# EAGLE design Adafruit I2C QT Rotary Encoder (EAGLE 9.6.2)
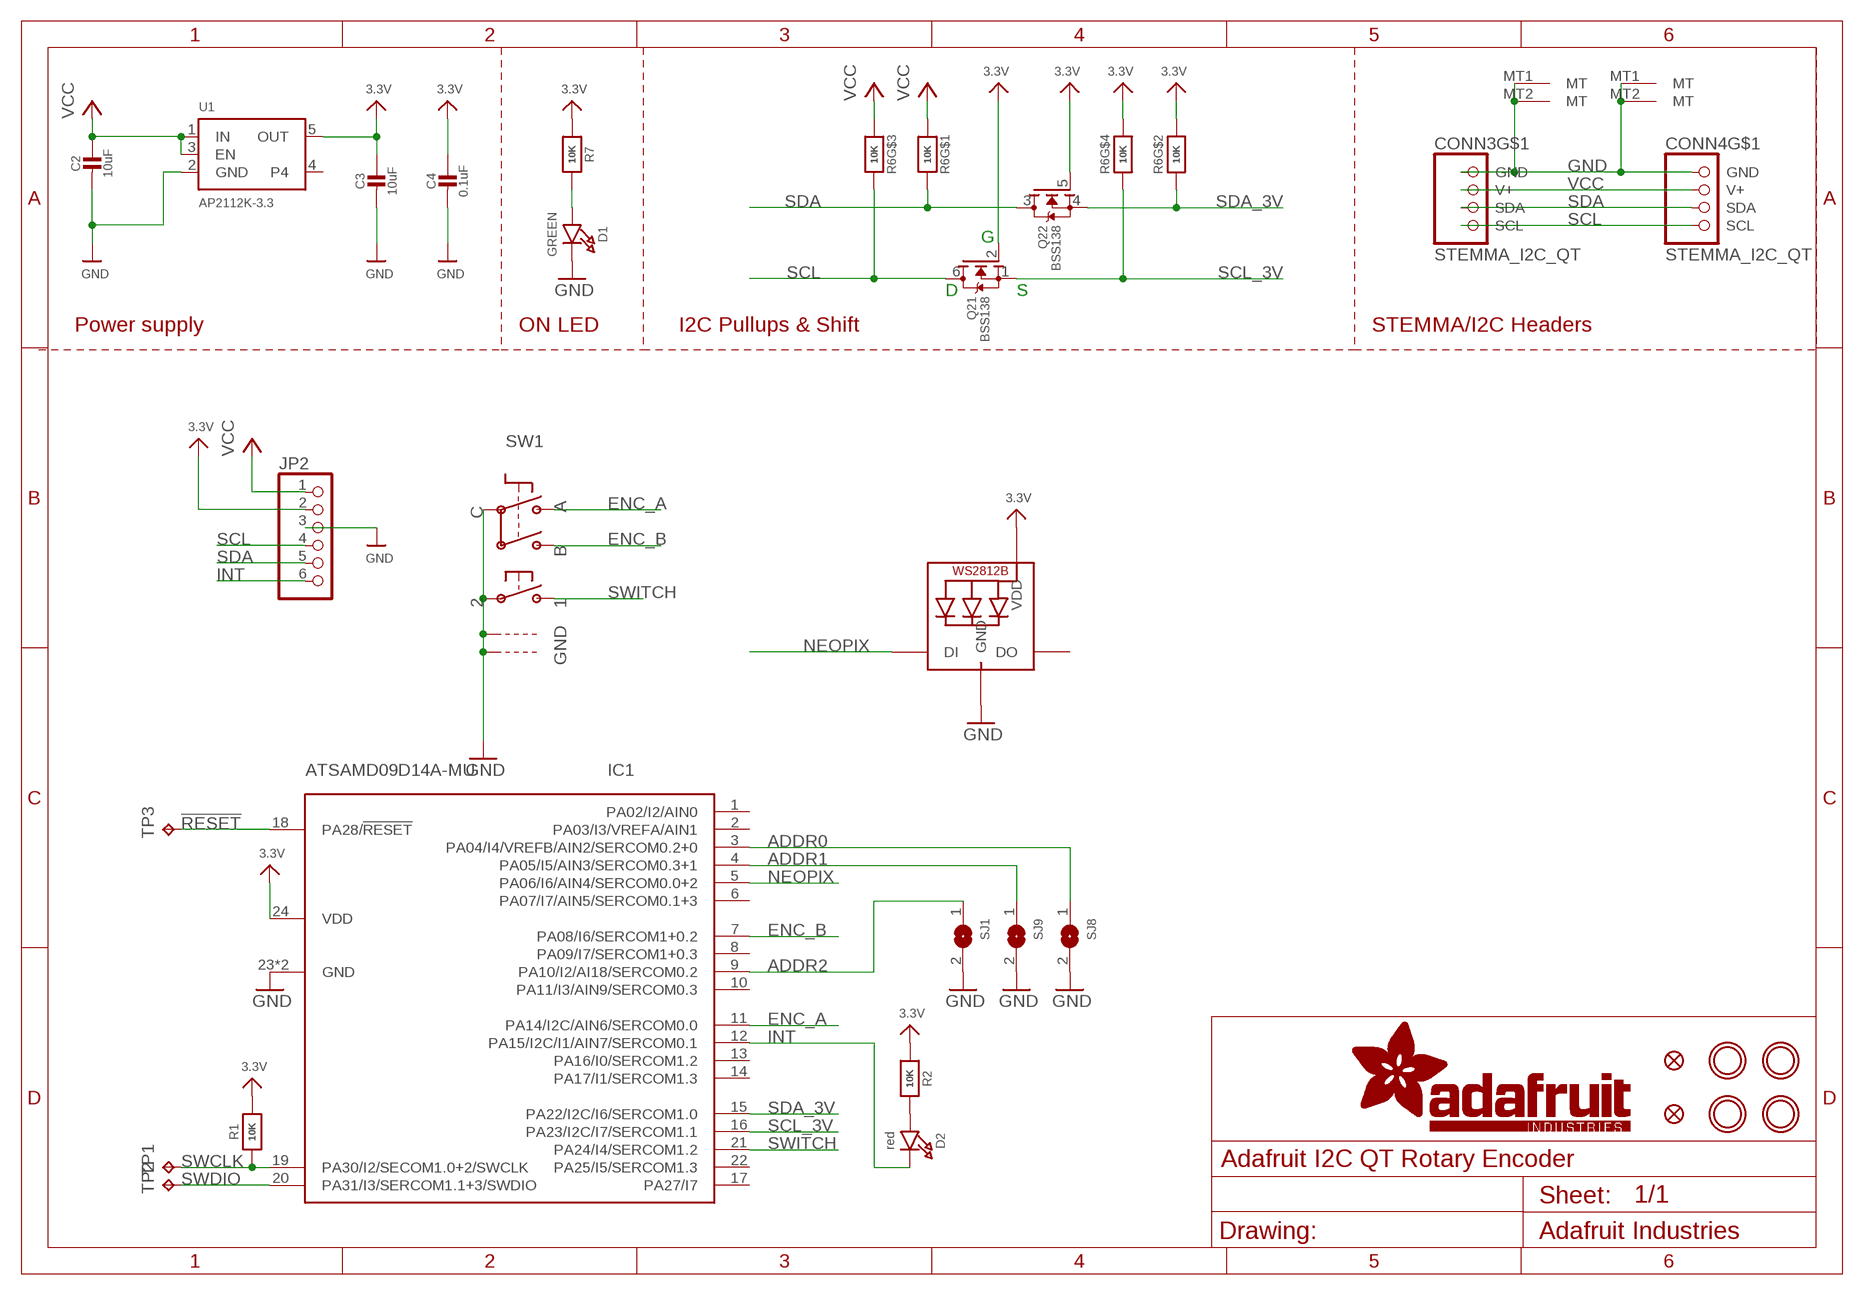
[diagram p0: schematic, sheet 1]

## Parts
C2  10uF  CAP_CERAMIC0805-NOOUTLINE  [0805-NO]
C3  10uF  CAP_CERAMIC0805-NOOUTLINE  [0805-NO]
C4  0.1uF  CAP_CERAMIC0603_NO  [0603-NO]
CONN3  STEMMA_I2C_QT  [JST_SH4]
CONN4  STEMMA_I2C_QT  [JST_SH4]
D1  GREEN  LED0603_NOOUTLINE  [CHIPLED_0603_NOOUTLINE]
D2  red  LED0603_NOOUTLINE  [CHIPLED_0603_NOOUTLINE]
FID3  FIDUCIAL_1MM  [FIDUCIAL_1MM]
FID4  FIDUCIAL_1MM  [FIDUCIAL_1MM]
IC1  ATSAMD09D14A-MU  [QFN24_4MM]
JP2  HEADER-1X670MIL  [1X06_ROUND_70]
LED1  WS2812B_SK6812E  [NEO3535_REVERSE]
Q2  BSS138  MOSFET-N_DUAL  [SOT363]
R1  10K  RESISTOR_0603_NOOUT  [0603-NO]
R2  10K  RESISTOR_0603_NOOUT  [0603-NO]
R6  10K  RESISTOR_4PACK  [RESPACK_4X0603]
R7  10K  RESISTOR_0603_NOOUT  [0603-NO]
SJ1  SOLDERJUMPER  [SOLDERJUMPER_ARROW_NOPASTE]
SJ8  SOLDERJUMPER  [SOLDERJUMPER_ARROW_NOPASTE]
SJ9  SOLDERJUMPER  [SOLDERJUMPER_ARROW_NOPASTE]
SW1  ENCODER_PLUS_SWITCH_BOURNS_PEC11  [PEC11+SWITCH]
TP1  TPTP15R  [TP15R]
TP2  TPTP15R  [TP15R]
TP3  TPTP15R  [TP15R]
U1  AP2112K-3.3  VREG_SOT23-5  [SOT23-5]
U$25  MOUNTINGHOLE2.5  [MOUNTINGHOLE_2.5_PLATED]
U$27  MOUNTINGHOLE2.5  [MOUNTINGHOLE_2.5_PLATED]
U$29  MOUNTINGHOLE2.5  [MOUNTINGHOLE_2.5_PLATED]
U$30  MOUNTINGHOLE2.5  [MOUNTINGHOLE_2.5_PLATED]

## Nets
3.3V: C3.1 C4.1 IC1.24(VDD) JP2.2 LED1.1-VDD(VDD) Q2.2(1:G) Q2.5(2:G) R1.2 R2.1 R6.2 R6.4 R7.1 U1.5(OUT)
!RESET: IC1.18(PA28/!RESET) TP3.TP
ADDR0: IC1.3(PA04/I4/VREFB/AIN2/SERCOM0.2+0) SJ8.1
ADDR1: IC1.4(PA05/I5/AIN3/SERCOM0.3+1) SJ9.1
ADDR2: IC1.9(PA10/I2/AI18/SERCOM0.2) SJ1.1
ENC_A: IC1.11(PA14/I2C/AIN6/SERCOM0.0) SW1.P$A
ENC_B: IC1.7(PA08/I6/SERCOM1+0.2) SW1.P$B
GND: C2.2 C3.2 C4.2 CONN3.1(GND) CONN3.MT1(MT) CONN3.MT2(MT) CONN4.1(GND) CONN4.MT1(MT) CONN4.MT2(MT) D1.C IC1.23(GND) IC1.THERM(GND) JP2.3 LED1.3-GND(GND) SJ1.2 SJ8.2 SJ9.2 SW1.P$2 SW1.P$C SW1.P$GND1 SW1.P$GND2 U1.2(GND)
INT: D2.C IC1.12(PA15/I2C/I1/AIN7/SERCOM0.1) JP2.6
N$1: D1.A R7.2
N$2: D2.A R2.2
NEOPIX: IC1.5(PA06/I6/AIN4/SERCOM0.0+2) LED1.4-DIN(DI)
SCL: CONN3.4(SCL) CONN4.4(SCL) JP2.4 Q2.6(1:D) R6.6
SCL_3V: IC1.16(PA23/I2C/I7/SERCOM1.1) Q2.1(1:S) R6.5
SDA: CONN3.3(SDA) CONN4.3(SDA) JP2.5 Q2.3(2:D) R6.8
SDA_3V: IC1.15(PA22/I2C/I6/SERCOM1.0) Q2.4(2:S) R6.7
SWCLK: IC1.19(PA30/I2/SECOM1.0+2/SWCLK) R1.1 TP1.TP
SWDIO: IC1.20(PA31/I3/SERCOM1.1+3/SWDIO) TP2.TP
SWITCH: IC1.21(PA24/I4/SERCOM1.2) SW1.P$1
VCC [highpower]: C2.1 CONN3.2(V+) CONN4.2(V+) JP2.1 R6.1 R6.3 U1.1(IN) U1.3(EN)
Unconnected: IC1.1(PA02/I2/AIN0) IC1.2(PA03/I3/VREFA/AIN1) IC1.6(PA07/I7/AIN5/SERCOM0.1+3) IC1.8(PA09/I7/SERCOM1+0.3) IC1.10(PA11/I3/AIN9/SERCOM0.3) IC1.13(PA16/I0/SERCOM1.2) IC1.14(PA17/I1/SERCOM1.3) IC1.17(PA27/I7) IC1.22(PA25/I5/SERCOM1.3) LED1.2-DOUT(DO) U1.4

## Notes on the sheet
- G
- D | S
- Power supply | ON LED | I2C Pullups & Shift | STEMMA/I2C Headers

## Library data of the parts
C2-C4 = microbuilder:CAP_CERAMIC: Ceramic Capacitors For new designs, use the packages preceded by an '_' character since they are more reliable: The following footprints should be used on most boards: _0402 - Standard footprint for regular board layouts _0603 - Standard footprint for regular board layouts _0805 - Standard footprint for regular board layouts _1206 - Standard footprint for regular board layouts For extremely tight-pitch boards where space is at a premium, the following 'micro-pitch' footprints can be used (smaller pads, no silkscreen outline, etc.): _0402MP - Micro-pitch footprint for very dense/compact boards _0603MP - Micro-pitch footprint for very dense/compact boards _0805MP - Micro-pitch footprint for very dense/compact boards _1206MP - Micro-pitch footprint for very dense/compact boards
CONN3 CONN4 = microbuilder:STEMMA_I2C
D1 D2 = microbuilder:LED: LED 0603 - 0603 Surface Mount Package 2mA: Green LED - Low Power (3.9mcd, 2ma, 1.7Vf) - Digikey: 475-2709-2-ND Orange LED - Low Power (9.8mcd, 2ma, 1.8Vf) - Digikey: 475-1194-2-ND Red LED - Low Power (5mcd, 2ma, 1.8Vf) - Digikey: 475-1195-2-ND Yellow LED - Low Power (7mcd, 2ma, 1.8Vf) - Digikey: 475-1196-2-ND 5mA: Blue LED - Low Power (17mcd, 5ma, 2.9Vf) - Digikey: LNJ937W8CRACT-ND 0805 - 0805 Surface Mount Package 2mA: Red LED (8.8mcd, 2mA, 1.8Vf, Clear) - Low Power [Digikey: 475-2510-1-ND] Green LED (5mcd, 2mA, 1.8Vf, Clear) - Low Power [Digikey: 475-2730-1-ND] Yellow LED (11.3mcd, 2mA, 1.8Vf, Clear) - Low Power [Digikey: 475-2555-1-ND] 20mA: Red LED (104mcd, 20mA, Diffused) - LS R976 [Digikey: 475-1278-6-ND] Red LED (12mcd, 20mA, 2.0Vf, Clear) - APT2012EC [Digikey: 754-1128-1-ND] Green LED (15mcd, 20mA, 2.2Vf, Clear) - APT2012GC [Digikey: 754-1131-1-ND] Orange LED (160mcd, 20mA, 2.1Vf, Clear) - APT2012SECK [Digikey: 754-1130-1-ND] 1206 - 1206 Surface Mount Package Green LED (26mcd, 20mA, Diffused) - LG N971 [Digikey: 475-1407-6-ND] Red LED (15mcd, 20mA, Diffused) - LH N974 [Digikey: 475-1416-6-ND] Cree - Cree High-Power Surface Mount LEDs XPEBWT-L1-0000-00D50 - White 111lm 350mA 2.9Vf 6200K 110° XTEAWT-00-0000-00000LEE3 - White 114lm 350mA 2.85Vf 5000K 115° Everlight - Everlight 45-21 Series Surface Mount LEDs 45-21/QK2C-B2832AC2CB2/2T - Warm White 2000mcd 20mA 3.25Vf 3050K 120° 45-21/LK2C-B38452C4CB2/2T - Nuetral White 2000mcd 20mA 3.25Vf 4150K 120° 45-21/LK2C-B50634C6CB2/2T - Cold White 2200mcd 20mA 3.25Vf 5650K 120° PLCC2 Reverse Mount LS T77K-J1L2-1-0-2-R18-Z - Red 11.25mcd 2mA 1.8Vf 630nm 120° LO T77K-L1M2-24-Z - Orange 19.6mcd 2mA 1.8Vf 606nm 120° LY T77K-K2M1-26-Z - Yellow 15.7mcd 2mA 1.8Vf 587nm 120°
FID3 FID4 = microbuilder:FIDUCIAL: Fiducial Alignment Points Various fiducial points for machine vision alignment.; BOM: EXCLUDE
IC1 = adafruit_micro:ATSAMD09D14A
JP2 = microbuilder:HEADER-1X6: PIN HEADER
LED1 = microbuilder:WS2812B
Q2 = microbuilder:MOSFET-N_DUAL: Dual N-Channel MOSFET SOT363 (2.0x1.25mm) 2N7002PS - 60V, 320mA [Digikey: 568-5984-1-ND]
R1 R2 R7 = microbuilder:RESISTOR: Resistors For new designs, use the packages preceded by an '_' character since they are more reliable: The following footprints should be used on most boards: _0402 - Standard footprint for regular board layouts _0603 - Standard footprint for regular board layouts _0805 - Standard footprint for regular board layouts _1206 - Standard footprint for regular board layouts For extremely tight-pitch boards where space is at a premium, the following 'micro-pitch' footprints can be used (smaller pads, no silkscreen outline, etc.): _0402MP - Micro-pitch footprint for very dense/compact boards _0603MP - Micro-pitch footprint for very dense/compact boards _0805MP - Micro-pitch footprint for very dense/compact boards _1206MP - Micro-pitch footprint for very dense/compact boards
R6 = microbuilder:RESISTOR_4PACK: Resistor Packs (4 resistors) 4 x 0603 10K 1/16W - Digikey: YC164J-10KCT-ND
SJ1 SJ8 SJ9 = microbuilder:SOLDERJUMPER: SMD Solder JUMPER Solder the two pads together to create a connection, or remove the solder to break it. REFLOW - Use this footprint for solder paste and reflow ovens. WAVE - Use this footprint for hand-soldering (larger pads). CLOSED - Has a trace between the two pads to ensure it is closed by default. The trace needs to be cut to disable the jumper, and can be closed again by creating a solder bridge between the two pads.; BOM: EXCLUDE
SW1 = adafruit_electromech:ENCODER_PLUS_SWITCH: Rotary Encoder with Built-In Switch PEC11 - 24 Step, PEC11-4215F-S24 - http://www.adafruit.com/products/377
TP1-TP3 = testpad:TP: Test pad
U1 = adafruit_power:VREG_SOT23-5: SOT23-5 Fixed Voltage Regulators Part Current Out V Out V In V Dropout θJA (°C/W) TJ (°C) Digikey Part No. ADP121 150mA 3.3V 3.4-5.5V 0.09V @ 150mA -- -- ADP121-AUJZ33R7CT-ND ADP121 150mA 3.0V 3.1-5.5V 0.09V @ 150mA -- -- ADP121-AUJZ30R7CT-ND ADP122 300mA 3.3V 3.4-5.5V 0.085V @ 300mA -- -- ADP122AUJZ-3.3-R7CT-ND ADP1712 300mA 3.3V 3.5-5.5V 0.17V @ 300mA -- -- ADP1712AUJZ-3.3-R7TR-ND AP7311 (Low Cost) 150mA 3.3V 3.5-6V 0.15V @ 150mA -- -- AP7311-33WG-7DICT-ND LD39015M18R 150mA 1.8V 1.9V-5.5V 0.08V @ 100mA -- -- 497-6977-1-ND LP2985A-33DBVR 150mA 3.3V 3.3-16V 0.28V @ 150mA 206 150 296-18479-1-ND MCP1824T-3302E/OT 300mA 3.3V 3.5V-6V 0.2V @ 300mA -- -- MCP1824T-3302E/OTCT-ND MIC5205-2.5YM5 TR 150mA 2.5V 2.7-16V 0.165V @ 150mA -- -- 576-1257-2-ND MIC5205-3.0YM5 TR 150mA 3.0V 3.2V-16V 0.165V @ 150mA -- -- 576-1258-2-ND MIC5205-3.3YM5 TR 150mA 3.3V 3.5V-16V 0.165V @ 150mA -- -- 576-1259-2-ND TPS780330220 150mA 3.3V+2.2V 3.6-5.5V 250mV Max -- -- 296-23332-1-ND TDA3663/N1,135 100mA 3.3V 3.5-45V 0.18V @ 50mA -- -- 568-5343-1-ND Max operating temp can be calculated using θJA, TJ (max junction temperature), and power in watts. Set the "Maximum Ambient Temperature" until it reaches TJ ("Max Junction Temperature"), which is the absolute limit for safe use of the regulator: Heat Sink Temperature Calculator <http://www.daycounter.com/Calculators/Heat-Sink-Temperature-Calculator.phtml> For example, With 12V source into a 3.3V LP2985 and a 30mA load, we are dissipating (12V-3.3V) * 0.03A = 0.261W. With a θJA of 206 °C/W, a TJ of 150°C, and 261mW we can safely use the chip without a heat sink up to 75°C (=147.1°C Junction Temperature).
U$25 U$27 U$29 U$30 = adafruit_electromech:MOUNTINGHOLE: Mounting Hole For #2 screws (0.086"/2.18mm width, 0.094"/2.4mm hole) use 2.5mm; BOM: EXCLUDE

## Net classes
1 highpower: width 0.406 mm, drill 0.483 mm
2 lowpower: width 0.305 mm, drill 0.483 mm

## Board
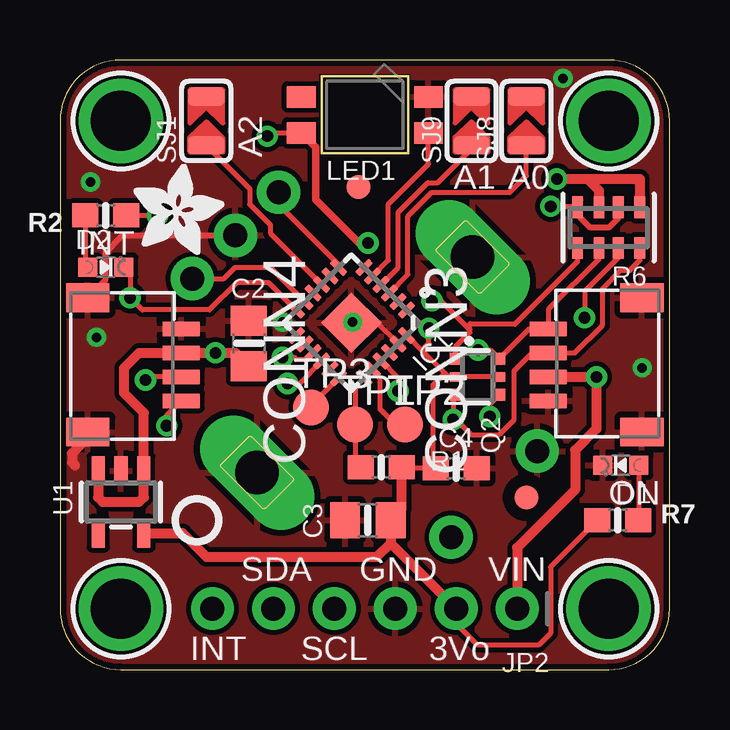
[diagram p1: board, top side]
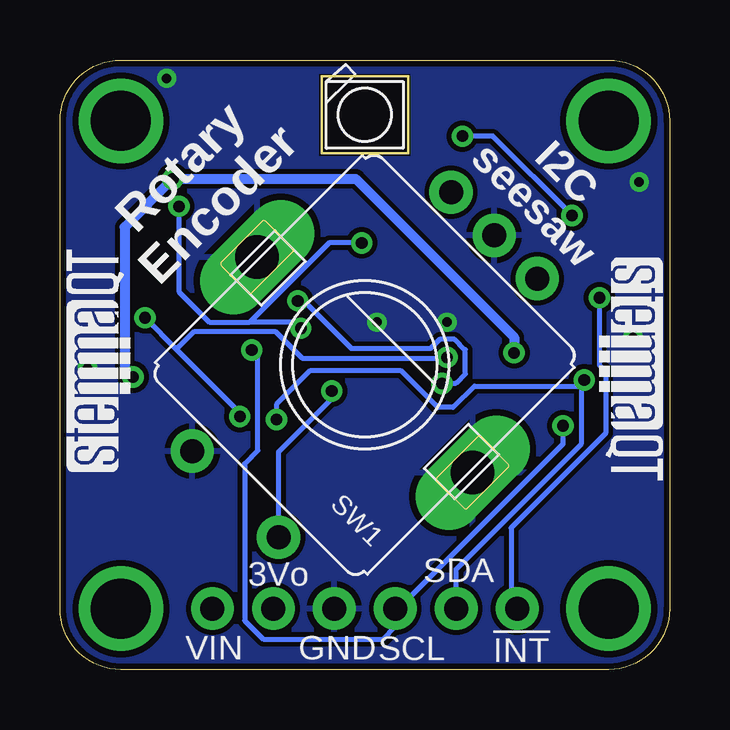
[diagram p2: board, bottom side, seen from below]

Size 25.4 x 25.4 mm. Coordinates in mm from the lower left corner, seen from the top.
Outline: 0,22.86 0,2.54 arc90 2.54,0 22.86,0 arc90 25.4,2.54 25.4,22.86 arc90 22.86,25.4 2.54,25.4 arc90 0,22.86
Copper layers (1*16): Top 0.035mm / dielectric 1.5mm / Bottom 0.035mm
Design rules "adafruit *": minimum track width 8mil, minimum drill 15.5mil, track to track 8mil, track to pad 8mil, pad to pad 8mil, via to via 8mil, smd to smd 8mil, copper to edge 10mil, drill to drill 8mil, minimum pad ring 10mil, minimum via ring 8mil, stop-mask expansion 2mil, vias tented up to drill 20mil, thermal gap 10mil

### Footprints (pad centres in the part's own frame; a part is rotated, then mirrored left to right if it is on the bottom)
0805-NO = smd 1.24 x 1.5: 1 -0.95,0; 2 0.95,0
0603-NO = smd 1.075 x 1: 1 -0.85,0; 2 0.85,0
JST_SH4 = smd 0.6 x 1.55: 1 -1.5,2.514; 2 -0.5,2.514; 3 0.5,2.514; 4 1.5,2.514 | smd 1.2 x 1.8: MT1 -2.8,-1.386; MT2 2.8,-1.386
CHIPLED_0603_NOOUTLINE = smd 0.8 x 0.8: A 0,-0.75; C 0,0.75
FIDUCIAL_1MM = smd 1 x 1: 1 0,0
QFN24_4MM = smd 0.8 x 0.28: 1 -2,1.25; 2 -2,0.75; 3 -2,0.25; 4 -2,-0.25; 5 -2,-0.75; 6 -2,-1.25; 13 2,-1.25; 14 2,-0.75; 15 2,-0.25; 16 2,0.25; 17 2,0.75; 18 2,1.25 | smd 0.28 x 0.8: 7 -1.25,-2; 8 -0.75,-2; 9 -0.25,-2; 10 0.25,-2; 11 0.75,-2; 12 1.25,-2; 19 1.25,2; 20 0.75,2; 21 0.25,2; 22 -0.25,2; 23 -0.75,2; 24 -1.25,2 | smd 1.778 x 1.778: THERM 0,0
1X06_ROUND_70 = drill 1 pad 1.778: 1 -6.35,0; 2 -3.81,0; 3 -1.27,0; 4 1.27,0; 5 3.81,0; 6 6.35,0
NEO3535_REVERSE = smd 1.2 x 0.9 bottom: 1-VDD 2.65,-0.75; 2-DOUT 2.65,0.75; 3-GND -2.65,0.75; 4-DIN -2.65,-0.75
SOT363 = smd 0.5 x 0.5: 1 -0.75,-0.9; 3 0.75,-0.9; 4 0.75,0.9; 6 -0.75,0.9 | smd 0.4 x 0.5: 2 0,-0.9; 5 0,0.9
RESPACK_4X0603 = smd 0.45 x 0.9: 1 -1.3,-0.85; 2 -0.4,-0.85; 3 0.4,-0.85; 4 1.3,-0.85; 5 1.3,0.85; 6 0.4,0.85; 7 -0.4,0.85; 8 -1.3,0.85
SOLDERJUMPER_ARROW_NOPASTE = smd 0.762 x 1.524: 1 -1.016,0; 2 1.016,0
PEC11+SWITCH = drill 1 pad 1.8: P$1 -2.54,7.62; P$2 2.54,7.62; P$A -2.54,-7.62; P$B 2.54,-7.62; P$C 0,-7.62 | drill 1.8 pad 2.8 long: P$GND1 -6.35,0; P$GND2 6.35,0
TP15R = smd 1.5 x 1.5: TP 0,0
SOT23-5 = smd 0.55 x 1.2: 1 -0.95,-1.3; 2 0,-1.3; 3 0.95,-1.3; 4 0.95,1.3; 5 -0.95,1.3
MOUNTINGHOLE_2.5_PLATED = drill 2.5 pad 3.2: P$1 0,0

### Placement (x,y rotation side)
C2  7.87,13.59 90 top
C3  12.83,6.22 180 top
C4  16.51,8.38 0 top
CONN3  22.86,12.7 90 top
CONN4  2.54,12.7 270 top
D1  23.37,8.51 90 top
D2  1.91,16.76 270 top
FID3  19.43,7.18 0 top
FID4  12.45,20.1 0 top
IC1  12.14,14.45 225 top
JP2  12.7,2.54 180 top
LED1  12.7,23.11 0 bottom
Q2  17.4,12.19 270 top
R1  13.39,8.43 0 top
R2  1.91,18.92 180 top
R6  22.86,18.41 180 top
R7  23.24,6.22 0 top
SJ1  6.1,22.86 90 top
SJ8  19.43,22.86 90 top
SJ9  17.14,22.86 90 top
SW1  12.7,12.7 135 bottom
TP1  12.29,10.21 0 top
TP2  14.38,10.21 0 top
TP3  10.46,10.92 0 top
U1  2.54,6.99 180 top
U$25  2.54,22.86 0 top
U$27  22.86,22.86 0 top
U$29  2.54,2.54 0 top
U$30  22.86,2.54 0 top
U$32  [ADAFRUIT_3.5MM]  3.05,17.27 0 top
U$33  [PCBFEAT-REV-040]  5.71,6.22 0 top
U$34  [STEMMAQT]  22.48,8.26 90 bottom
U$35  [STEMMAQT]  2.92,17.14 270 bottom

### Tracks (layer width: path | path; a pad name or v marks a point on that pad's centre or on a via)
3.3V  (via drill 0.48)
  Top 0.203: IC1.24 15.07,13.29 | 16.02,12.34 16.17,12.19 Q2.2 Q2.5 | 16.02,12.34 15.07,13.29 | 15.07,13.29 15.37,13.59 v15.37,14.22 | v20.45,19.3 21.56,19.3 | 21.56,19.56 21.69,19.56 | R1.2 14.29,8.38 C4.1 15.53,8.51 15.53,11.85 16.02,12.34 | R7.1 20.45,4.28 20.45,1.52 19.94,1.02 17.4,1.02 16.51,1.91 JP2.2 | R2.1 v4.06,18.92 | v8.64,22.23 8.78,22.36 LED1.1-VDD
  Top 0.254: R6.2 23.26,18.82 22.86,18.41 22.1,18.41 21.69,18.83 21.69,19.56 | 21.56,19.56 21.56,19.3 R6.4
  Top 0.305: LED1.1-VDD 10.65,21.77 10.65,19.57 12.44,17.78 v12.83,17.78
  Top 0.406: R1.2 14.24,6.68 C3.1 13.78,5.27 | 13.78,5.27 JP2.2 | U1.5 5.11,5.68 6.1,4.7 13.2,4.7 13.78,5.27
  Bottom 0.203: 17.49,14.48 15.62,14.48 v15.37,14.22 | v20.45,19.3 20.45,15.75 19.18,14.48 17.49,14.48 | v12.83,17.78 14.19,17.78 17.49,14.48 | v4.06,18.92 7.37,22.23 v8.64,22.23
!RESET
  Top 0.203: IC1.18 10.46,11.01 TP3.TP
ADDR0
  Top 0.203: IC1.3 14.49,16.45 14.49,18.89 15.49,19.89 18.74,19.89 19.43,20.57 SJ8.1
ADDR1
  Top 0.203: IC1.4 14.09,16.75 14.09,19.05 15.33,20.29 15.75,20.29 17.14,21.69 SJ9.1
ADDR2
  Top 0.203: SJ1.1 7.9,20.04 7.9,19.39 8.76,18.52 8.76,18.18 IC1.9
ENC_A
  Top 0.203: SW1.P$A 6.83,16.29 7.3,16.76 8.77,16.76 IC1.11
ENC_B
  Top 0.203: IC1.7 11.61,16.87 9.11,19.38 SW1.P$B
GND  (via drill 0.39)
  Top 0.203: IC1.23 13.18,14.48 v12.19,14.48 12.17,14.48 IC1.THERM
  Top 0.254: CONN4.MT1 1.69,16.03 1.91,16.25 1.91,17.4 2.59,18.09 SW1.P$C
  Top 0.406: CONN4.MT2 1.15,9.66 0.51,9.02 0.51,8.64 0.64,8.51
  other vias: 9.27,14.48 1.52,13.84 1.27,20.32 24.26,12.57 20.95,24.64
  pour Top: 0,25.4 25.4,25.4 25.4,0 0,0
  pour Bottom: 0,25.4 25.4,25.4 25.4,0 0,0
INT  (via drill 0.48)
  Top 0.203: D2.C 2.92,16.5 v2.92,15.49 3.43,14.99 6.22,14.99 7.37,16.13 8.7,16.13 IC1.12
  Bottom 0.203: v2.92,15.49 2.92,12.7 2.67,12.45 2.67,9.84 6.6,5.9 6.6,2.79 JP2.6
N$1
  Top 0.203: D1.A 24.12,6.25 R7.2
N$2
  Top 0.203: R2.2 1.05,16.86 D2.A
NEOPIX
  Top 0.203: IC1.5 13.68,17.05 13.68,19.4 15.35,21.07 LED1.4-DIN
SCL  (via drill 0.48)
  Top 0.203: CONN4.4 4.45,10.59 v4.45,10.16 | R6.6 22.46,17.13 20.35,15.01 CONN3.4 19.56,14.2 Q2.6 17.92,13.32 v17.41,13.32
  Bottom 0.203: v4.45,10.16 4.45,9.4 11.3,2.54 JP2.4 11.43,1.78 11.94,1.27 16.93,1.27 17.7,2.05 17.7,8.59 17.16,9.13 17.16,13.07 v17.41,13.32
SCL_3V  (via drill 0.48)
  Top 0.203: R6.5 21.56,16.99 18.96,14.39 17.11,14.39 17.08,14.41 17.08,14.16 | Q2.1 16.5,13.47 17.08,14.05 17.08,14.16 | IC1.16 9.96,11.92 v9.49,11.92 | 17.08,14.16 15.75,15.49 15.62,15.49 v15.49,15.37
  Bottom 0.203: v9.49,11.92 9.47,11.94 8.89,11.94 8.51,12.32 8.51,13.34 8.54,13.34 8.96,13.76 9.58,13.76 9.97,13.37 13.25,13.37 15.24,15.37 v15.49,15.37
SDA  (via drill 0.48)
  Top 0.203: CONN4.3 3.69,12.2 v3.56,12.06 | 16.38,10.54 17.13,9.79 18.3,9.79 18.92,10.41 18.92,12.45 19.68,13.2 CONN3.3 21.45,13.2 22.61,14.35 22.61,15.88 23.37,16.64 23.75,16.64 24.16,17.05 R6.8 | 16.38,10.54 16.38,11.33 Q2.3 | v16.38,10.41 16.38,10.54
  Bottom 0.203: JP2.5 8.89,4.19 3.68,9.4 3.68,11.94 v3.56,12.06 3.81,11.81 8.13,11.81 9.02,10.92 9.65,10.92 11.18,12.45 14.99,12.45 16.38,11.05 v16.38,10.41
SDA_3V  (via drill 0.48)
  Top 0.203: R6.7 23.26,17.16 21.86,15.76 v21.86,14.66 | Q2.4 17.91,11.05 v17.91,10.54 | v9.27,13.01 9.76,13.01 9.86,12.91 10.25,12.91 IC1.15
  Bottom 0.203: v21.86,14.66 20.55,13.36 | 20.55,13.36 17.91,10.71 v17.91,10.54 | v9.27,13.01 9.32,12.97 15.3,12.97 16.4,14.07 19.84,14.07 20.55,13.36
SWCLK
  Top 0.203: IC1.19 12.29,11.78 TP1.TP 12.29,8.68 R1.1
SWDIO
  Top 0.203: IC1.20 13.03,12.43 13.33,12.13 13.33,10.88 13.99,10.21 TP2.TP
SWITCH  (via drill 0.48)
  Top 0.203: IC1.21 14.08,12.16 v14.08,11.61
  Bottom 0.203: v14.08,11.61 14.08,11.29 16.29,9.07 SW1.P$1
VCC  (via drill 0.48)
  Top 0.406: C2.1 7.31,13.2 v6.48,13.2 CONN4.2 3.29,13.2 2.67,12.57 2.67,11.52 3.49,10.7 U1.1 3.49,7.17 3.3,6.99 1.78,6.99 1.59,7.17 U1.3 | CONN3.2 v22.34,12.2 v22.35,12.19 22.35,10.03 21.46,9.14 21.46,7.49 19.05,5.08 JP2.1 | R6.1 24.16,20.45 v20.7,20.45 21.97,20.45 22.46,19.96 R6.3
  Bottom 0.406: v22.35,12.19 22.71,12.55 22.71,18.44 v20.7,20.45 13.08,20.45 6.48,13.84 v6.48,13.2

### Text on the board
tPlace: A2 | A1 | A0 | INT | ON | SDA | GND | VIN | INT | SCL | 3Vo
bPlace: I2C / seesaw | Rotary / Encoder | SDA | 3Vo | !INT | SCL | GND | VIN